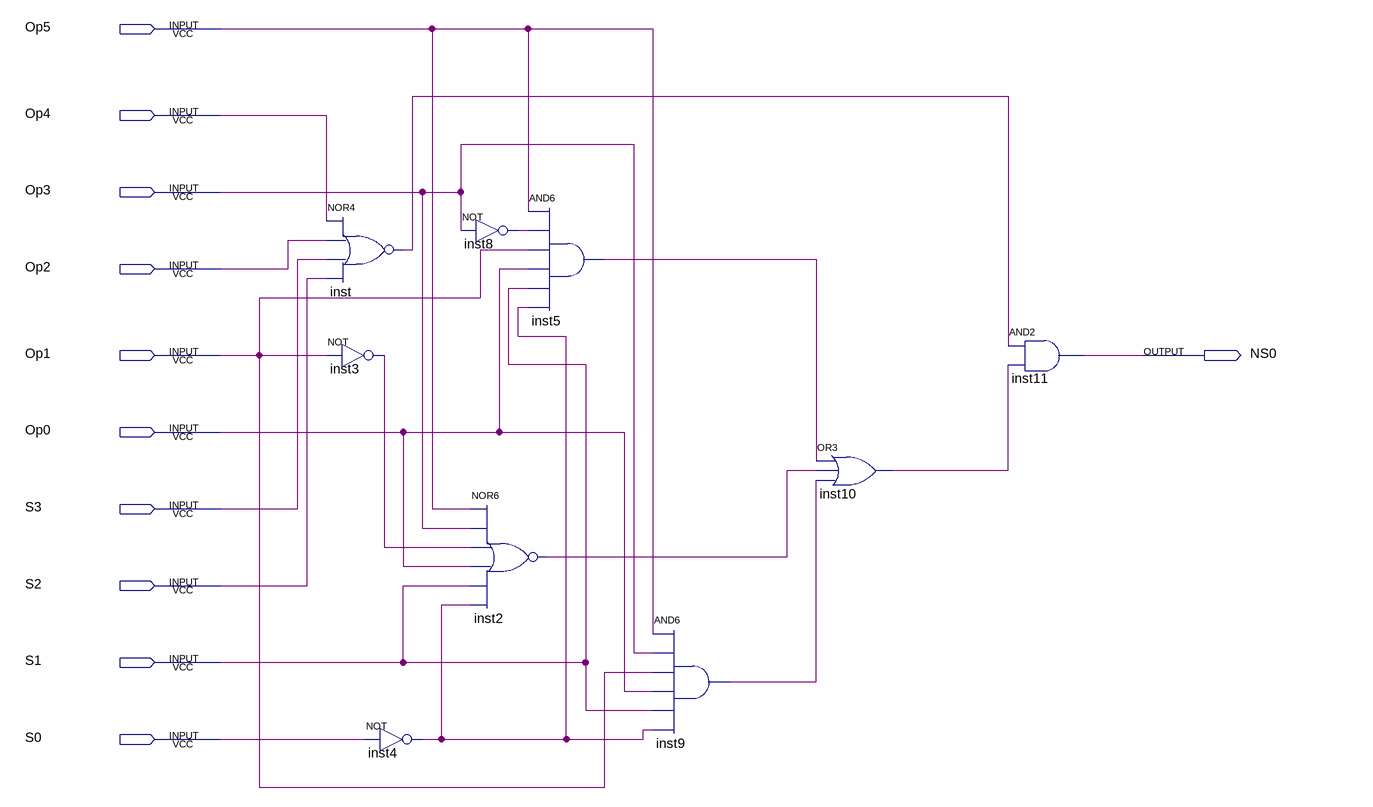
[diagram p0: schematic sheet]
// Quartus schematic NS0.bdf as structural Verilog: 9 symbols, 11 pins
module NS0 (
  input  Op5,
  input  Op4,
  input  Op3,
  input  Op2,
  input  Op1,
  input  Op0,
  input  S3,
  input  S2,
  input  S1,
  input  S0,
  output NS0
);

  wire inst2_out, inst3_out, inst4_out, inst5_out, inst8_out, inst9_out, inst10_out, inst_out;

  nor inst (inst_out, Op4, Op2, S3, S2);
  not inst3 (inst3_out, Op1);
  not inst4 (inst4_out, S0);
  and inst5 (inst5_out, Op5, inst8_out, Op1, Op0, S1, inst4_out);
  not inst8 (inst8_out, Op3);
  nor inst2 (inst2_out, Op5, Op3, inst3_out, Op0, S1, inst4_out);
  and inst9 (inst9_out, Op5, Op3, Op1, Op0, S1, inst4_out);
  or inst10 (inst10_out, inst5_out, inst2_out, inst9_out);
  and inst11 (NS0, inst_out, inst10_out);
endmodule
